# EAGLE design WebBrick6-0-64 (EAGLE 4.16)
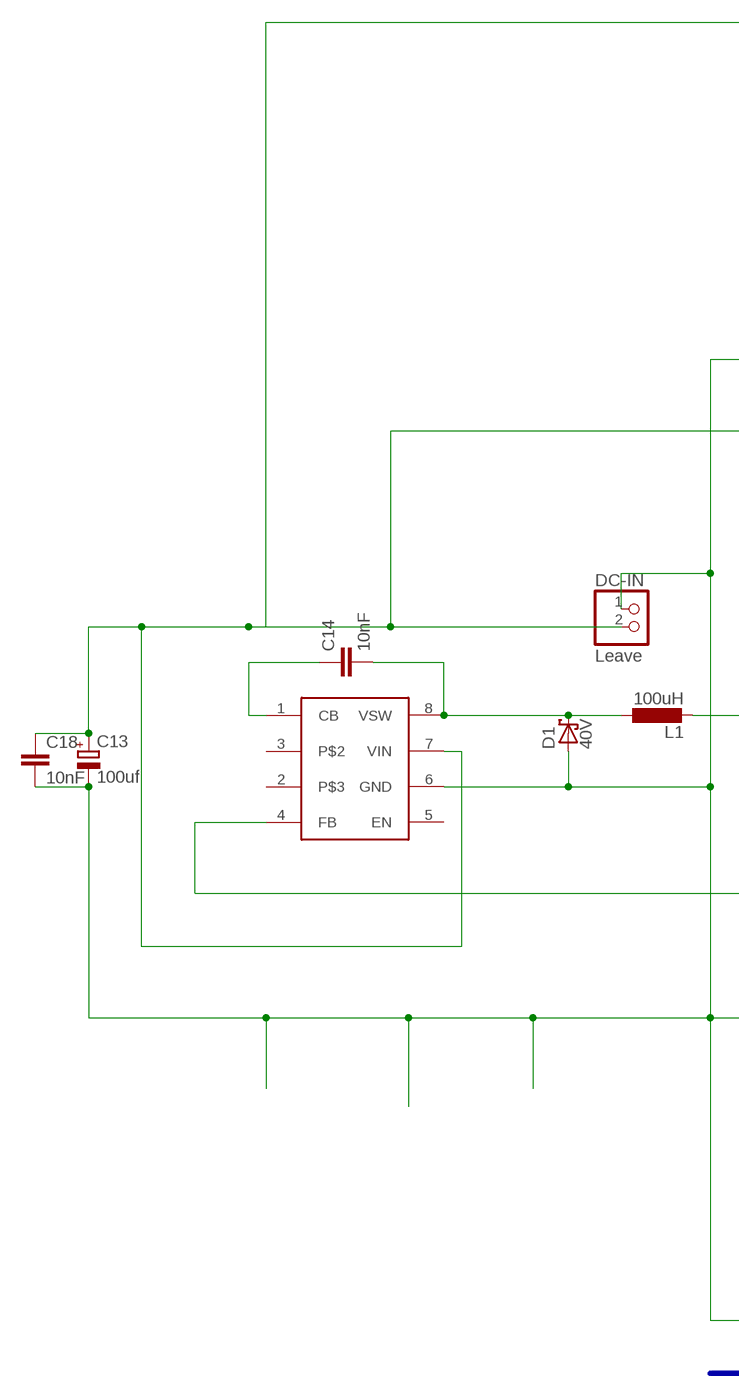
[diagram p0: schematic, sheet 1, part 1 of 2]
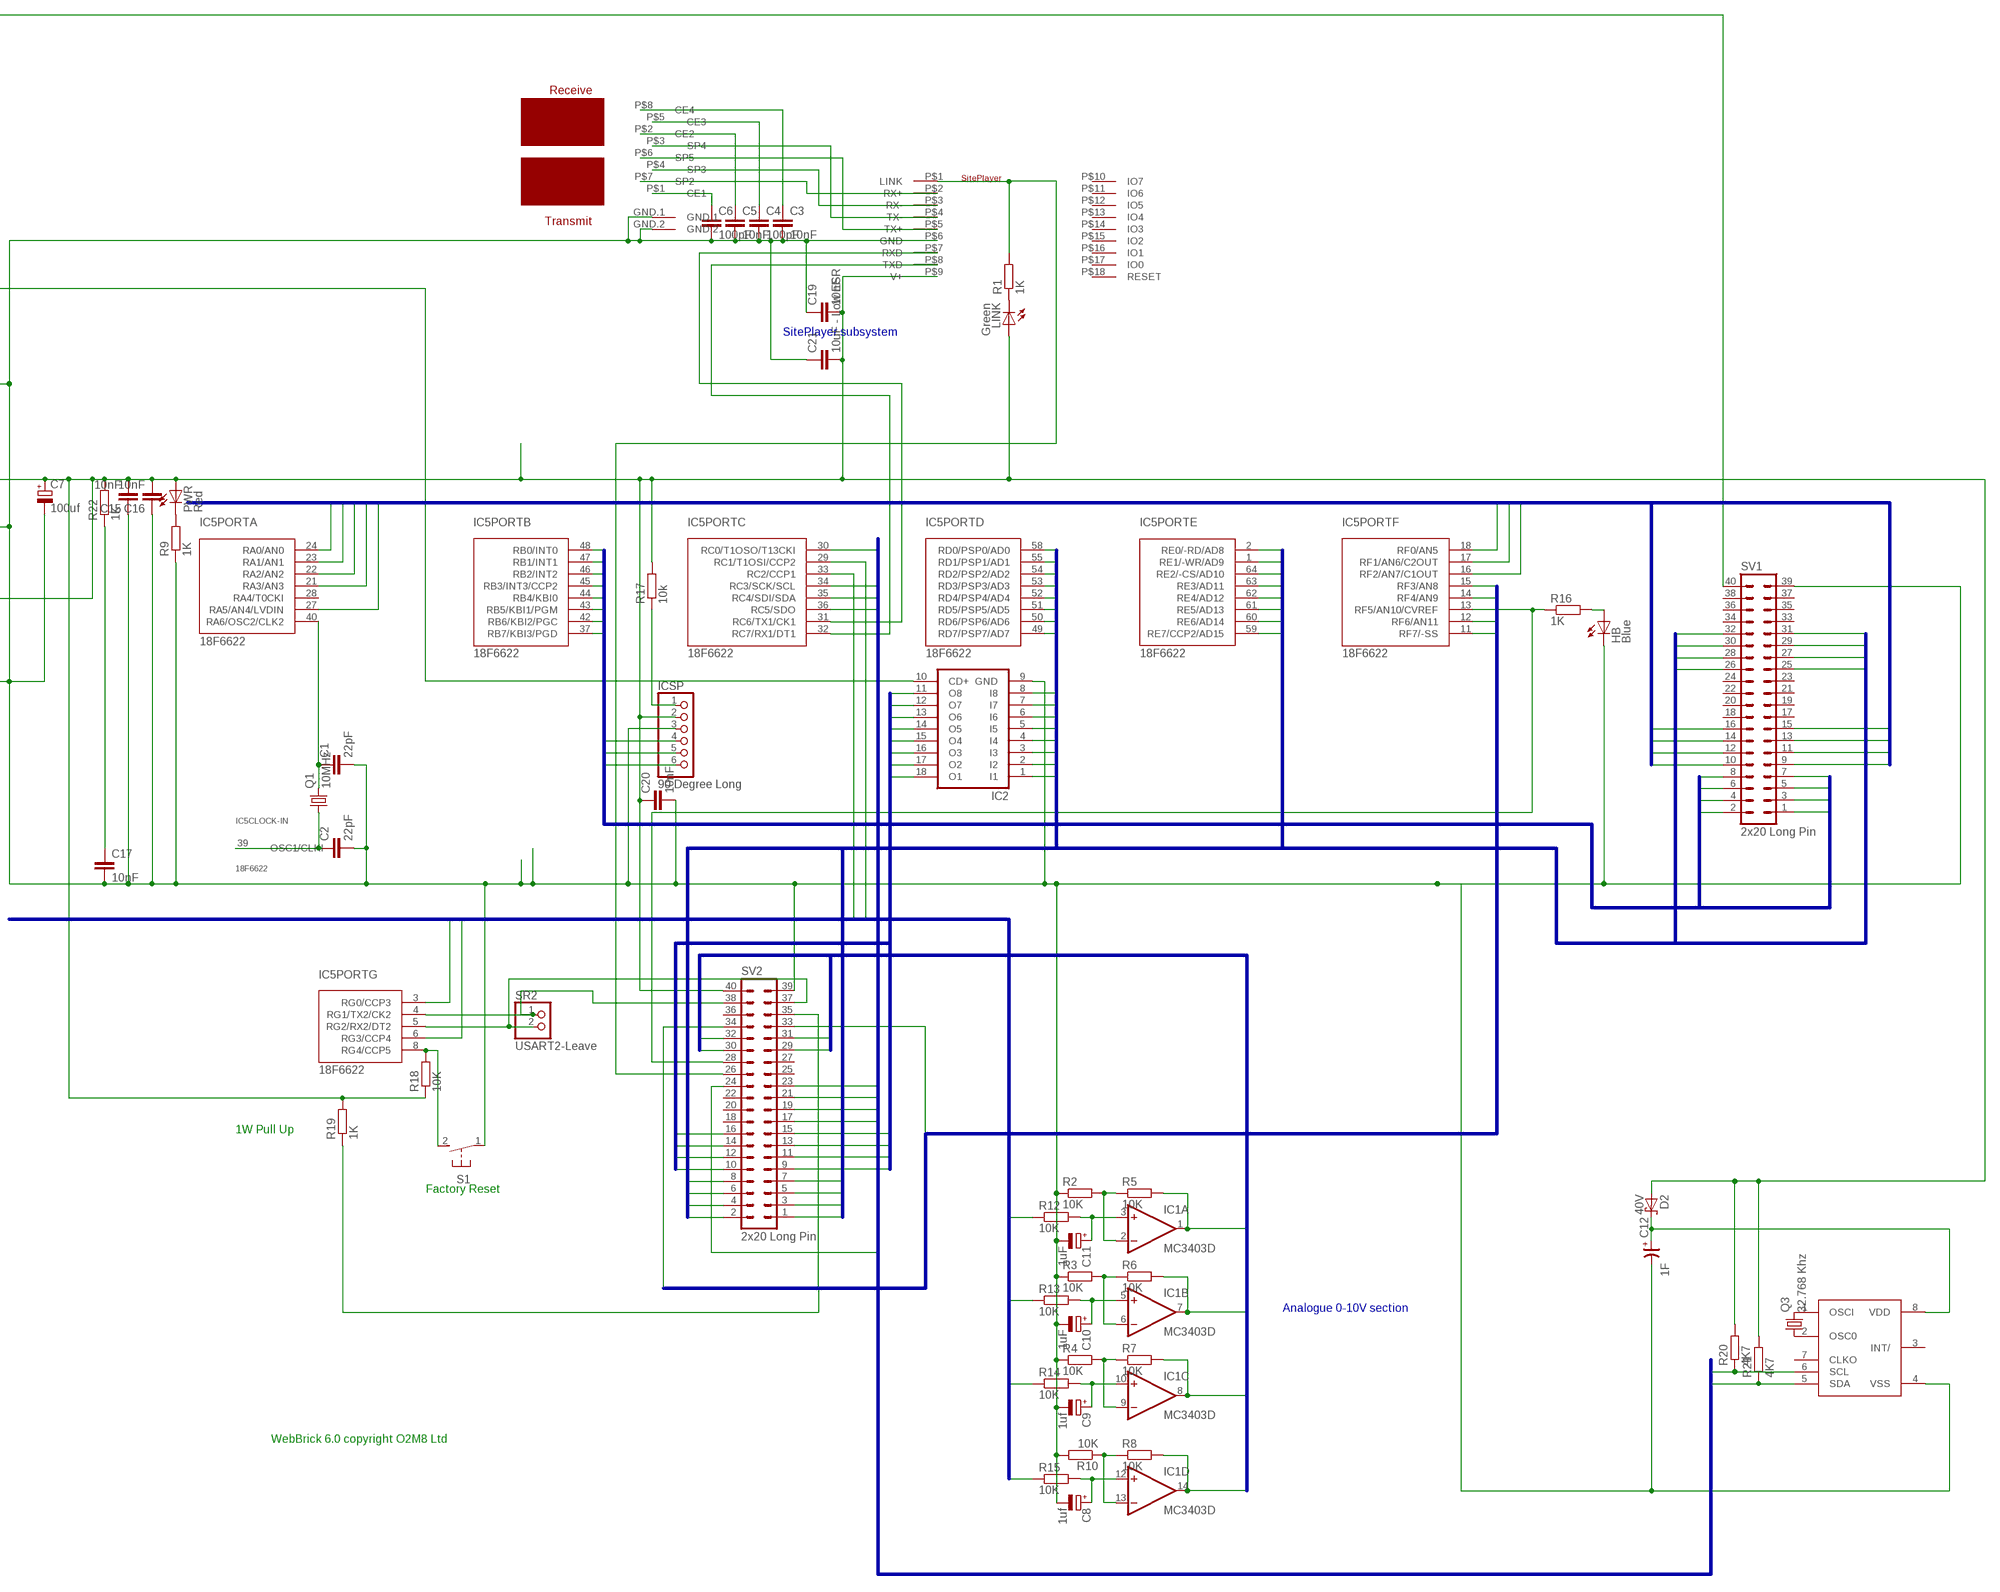
[diagram p1: schematic, sheet 1, part 2 of 2]

## Parts
C1  22pF  C-EUC1206  [C1206]
C2  22pF  C-EUC1206  [C1206]
C3  10nF  C-EUC1206  [C1206]
C4  100pF  C-EUC1206  [C1206]
C5  10nF  C-EUC1206  [C1206]
C6  100pF  C-EUC1206  [C1206]
C7  100uf  CPOL-EUF  [PANASONIC_F]
C8  1uf  CPOL-EUA/3216-18W  [A/3216-18W]
C9  1uf  CPOL-EUA/3216-18W  [A/3216-18W]
C10  1uF  CPOL-EUA/3216-18W  [A/3216-18W]
C11  1uF  CPOL-EUA/3216-18W  [A/3216-18W]
C12  1F  CP-SUPERCAPHORIZONTAL  [SUPERCAP-HORIZONTAL]
C13  100uf  CPOL-EUF  [PANASONIC_F]
C14  10nF  C-EUC1206  [C1206]
C15  10nF  C-EUC1206  [C1206]
C16  10nF  C-EUC1206  [C1206]
C17  10nF  C-EUC1206K  [C1206K]
C18  10nF  C-EUC1206K  [C1206K]
C19  10nF  C-EUC1206K  [C1206K]
C20  10nF  C-EUC1206K  [C1206K]
C21  10uF - Low ESR  C-EUC3216  [C3216]
D1  40V  SCHOTTKY-DIODE  [SOD123]
D2  40V  SCHOTTKY-DIODE  [SOD123]
DC-IN  Leave  PINHD-1X2  [1X02]
HB  Blue  LEDSMT1206  [1206]
IC1  MC3403D  MC34004D  [SO14]
IC2  ULN2803ASO18W  [SO18W]
IC3  PFC8563  PFC8563SO8  [SO8]
IC5  18F6622  PIC18F6720-I/PT  [TQFP64-10X10]
ICSP  90 Degree Long  PINHD-1X6  [1X06]
L1  100uH  L-EUL5650M  [L5650M]
LINK  Green  LEDSMT1206  [1206]
PWR  Red  LEDSMT1206  [1206]
Q1  10MHz  CRYTALHC49UP  [HC49UP]
Q3  32.768 Khz  CRYTALTC26V  [TC26V]
R1  1K  R-EU_R1206  [R1206]
R2  10K  R-EU_M1206  [M1206]
R3  10K  R-EU_M1206  [M1206]
R4  10K  R-EU_M1206  [M1206]
R5  10K  R-EU_M1206  [M1206]
R6  10K  R-EU_M1206  [M1206]
R7  10K  R-EU_M1206  [M1206]
R8  10K  R-EU_M1206  [M1206]
R9  1K  R-EU_R1206  [R1206]
R10  10K  R-EU_M1206  [M1206]
R12  10K  R-EU_M1206  [M1206]
R13  10K  R-EU_M1206  [M1206]
R14  10K  R-EU_M1206  [M1206]
R15  10K  R-EU_M1206  [M1206]
R16  1K  R-EU_M1206  [M1206]
R17  10k  R-EU_M1206  [M1206]
R18  10K  R-EU_M1206  [M1206]
R19  1K  R-EU_R1206  [R1206]
R20  4K7  R-EU_R1206  [R1206]
R21  4K7  R-EU_R1206  [R1206]
R22  1K  R-EU_R1206  [R1206]
S1  31-XX  [B3F-31XX]
SR2  USART2-Leave  PINHD-1X2  [1X02]
SV1  2x20 Long Pin  MA20-2  [MA20-2]
SV2  2x20 Long Pin  MA20-2  [MA20-2]
U$1  2off 1x9 PH  SP  [SITEPLAYER]
U$2  PCA EPJ9372  PULSETRANSFORMER  [PULSETRANSFORMER]
U$3  LM2674-5  [SO08]

## Nets
ANALOGUE0: IC5.33(PORTC:RC2/CCP1) R12.1
ANALOGUE1: IC5.29(PORTC:RC1/T1OSI/CCP2) R13.1
ANALOGUE2: IC5.3(PORTG:RG0/CCP3) R14.1
ANALOGUE3: IC5.6(PORTG:RG3/CCP4) R15.1
ANALOGUEIN0: IC5.24(PORTA:RA0/AN0) SV1.9
ANALOGUEIN1: IC5.23(PORTA:RA1/AN1) SV1.10
ANALOGUEIN2: IC5.22(PORTA:RA2/AN2) SV1.11
ANALOGUEIN3: IC5.21(PORTA:RA3/AN3) SV1.12
ANALOGUEIN4: IC5.27(PORTA:RA5/AN4/LVDIN) SV1.13
ANALOGUEIN5: IC5.18(PORTF:RF0/AN5) SV1.14
ANALOGUEIN6: IC5.17(PORTF:RF1/AN6/C2OUT) SV1.15
ANALOGUEIN7: IC5.16(PORTF:RF2/AN7/C1OUT) SV1.16
ANOUT0: IC1.1(A:OUT) R5.2 SV2.29
ANOUT1: IC1.7(B:OUT) R6.2 SV2.30
ANOUT2: IC1.8(C:OUT) R7.2 SV2.31
ANOUT3: IC1.14(D:OUT) R8.2 SV2.32
AVDD: C17.1 R22.1
CKI: IC5.30(PORTC:RC0/T1OSO/T13CKI) SV2.24
DATA [SUPPLY]: IC5.15(PORTF:RF3/AN8) R19.1 SV2.35
DINPUTS0: IC5.48(PORTB:RB0/INT0) SV1.1
DINPUTS1: IC5.47(PORTB:RB1/INT1) SV1.2
DINPUTS2: IC5.46(PORTB:RB2/INT2) SV1.3
DINPUTS3: IC5.45(PORTB:RB3/INT3/CCP2) SV1.4
DINPUTS4: IC5.44(PORTB:RB4/KBI0) SV1.5
DINPUTS5: IC5.43(PORTB:RB5/KBI1/PGM) ICSP.6 SV1.6
DINPUTS6: IC5.42(PORTB:RB6/KBI2/PGC) ICSP.5 SV1.7
DINPUTS7: IC5.37(PORTB:RB7/KBI3/PGD) ICSP.4 SV1.8
DOUTPUTS0: IC2.1(I1) IC5.58(PORTD:RD0/PSP0/AD0) SV2.1
DOUTPUTS1: IC2.2(I2) IC5.55(PORTD:RD1/PSP1/AD1) SV2.2
DOUTPUTS2: IC2.3(I3) IC5.54(PORTD:RD2/PSP2/AD2) SV2.3
DOUTPUTS3: IC2.4(I4) IC5.53(PORTD:RD3/PSP3/AD3) SV2.4
DOUTPUTS4: IC2.5(I5) IC5.52(PORTD:RD4/PSP4/AD4) SV2.5
DOUTPUTS5: IC2.6(I6) IC5.51(PORTD:RD5/PSP5/AD5) SV2.6
DOUTPUTS6: IC2.7(I7) IC5.50(PORTD:RD6/PSP6/AD6) SV2.7
DOUTPUTS7: IC2.8(I8) IC5.49(PORTD:RD7/PSP7/AD7) SV2.8
DOUTPUTS8: IC5.2(PORTE:RE0/-RD/AD8) SV1.25
DOUTPUTS9: IC5.1(PORTE:RE1/-WR/AD9) SV1.26
DOUTPUTS10: IC5.64(PORTE:RE2/-CS/AD10) SV1.27
DOUTPUTS11: IC5.63(PORTE:RE3/AD11) SV1.28
DOUTPUTS12: IC5.62(PORTE:RE4/AD12) SV1.29
DOUTPUTS13: IC5.61(PORTE:RE5/AD13) SV1.30
DOUTPUTS14: IC5.60(PORTE:RE6/AD14) SV1.31
DOUTPUTS15: IC5.59(PORTE:RE7/CCP2/AD15) SV1.32
DRIVE [SUPPLY]: IC5.14(PORTF:RF4/AN9)
GND [SUPPLY]: C1.2 C2.2 C3.2 C4.2 C5.2 C6.2 C7.- C8.- C9.- C10.- C11.- C12.C-(-) C13.- C15.1 C16.1 C17.2 C18.2 C19.1 C20.2 C21.1 D1.A DC-IN.1 HB.C IC2.9(GND) IC3.4(VSS) ICSP.3 R2.1 R3.1 R4.1 R9.1 R10.2 S1.1(P) SV1.39 SV2.39 U$1.P$6(GND) U$2.GND.1 U$2.GND.2 U$3.6(GND)
LINK: R1.2 SV2.26 U$1.P$1(LINK)
N$2: C1.1 IC5.40(PORTA:RA6/OSC2/CLK2) Q1.2
N$3: C2.1 IC5.39(CLOCK-IN:OSC1/CLKI) Q1.1
N$4 [SUPPLY]: C14.1 U$3.1(CB)
N$6 [SUPPLY]: C14.2 D1.C L1.1 U$3.8(VSW)
N$7: IC5.31(PORTC:RC6/TX1/CK1) U$1.P$7(RXD)
N$8: IC5.32(PORTC:RC7/RX1/DT1) U$1.P$8(TXD)
N$9: U$1.P$2(RX+) U$2.P$7(SP2)
N$10: LINK.C R1.1
N$11: IC5.8(PORTG:RG4/CCP5) R18.2 S1.2(S)
N$12: U$1.P$3(RX-) U$2.P$4(SP3)
N$13: U$1.P$4(TX-) U$2.P$3(SP4)
N$14: U$1.P$5(TX+) U$2.P$6(SP5)
N$15: C3.1 U$2.P$8(CE4)
N$16: C4.1 U$2.P$5(CE3)
N$17: C5.1 U$2.P$2(CE2)
N$18: PWR.C R9.2
N$19: C6.1 U$2.P$1(CE1)
N$21: IC1.6(B:-IN) R3.2 R6.1
N$22: IC1.2(A:-IN) R2.2 R5.1
N$23: C8.+ IC1.12(D:+IN) R15.2
N$24: IC5.13(PORTF:RF5/AN10/CVREF) R16.1 SV2.28
N$25: HB.A R16.2
N$26 [InSupply]: C12.C+(+) D2.C IC3.8(VDD)
N$28: IC3.1(OSCI) Q3.2
N$29: IC3.2(OSC0) Q3.1
N$30: C11.+ IC1.3(A:+IN) R12.2
N$31: C10.+ IC1.5(B:+IN) R13.2
N$32: C9.+ IC1.10(C:+IN) R14.2
N$33: IC1.9(C:-IN) R4.2 R7.1
N$35: IC1.13(D:-IN) R8.1 R10.1
OC0 [drive]: IC2.18(O1) SV2.9
OC1 [drive]: IC2.17(O2) SV2.10
OC2 [drive]: IC2.16(O3) SV2.11
OC3 [drive]: IC2.15(O4) SV2.12
OC4 [drive]: IC2.14(O5) SV2.13
OC5 [drive]: IC2.13(O6) SV2.14
OC6 [drive]: IC2.12(O7) SV2.15
OC7 [drive]: IC2.11(O8) SV2.16
ROTA [SUPPLY]: IC5.12(PORTF:RF6/AN11) SV2.33
ROTB: IC5.11(PORTF:RF7/-SS) SV2.34
SCA: IC3.5(SDA) IC5.35(PORTC:RC4/SDI/SDA) R21.1 SV2.21
SCL: IC3.6(SCL) IC5.34(PORTC:RC3/SCK/SCL) R20.1 SV2.17 SV2.23
SDO: IC5.36(PORTC:RC5/SDO) SV2.19
USART2RX: IC5.5(PORTG:RG2/RX2/DT2) SR2.2 SV2.37
USART2TX: IC5.4(PORTG:RG1/TX2/CK2) SR2.1 SV2.38
V+ [InSupply]: C13.+ C18.1 DC-IN.2 IC2.10(CD+) SV1.40 U$3.7(VIN)
VDD [SUPPLY]: C7.+ C15.2 C16.2 C19.2 C20.1 C21.2 D2.A ICSP.2 L1.2 LINK.A PWR.A R17.2 R18.1 R19.2 R20.2 R21.2 R22.2 SV2.40 U$1.P$9(V+) U$3.4(FB)
VPP: ICSP.1 R17.1
Unconnected: IC3.3(INT/) IC3.7(CLKO) IC5.28(PORTA:RA4/T0CKI) SV1.17 SV1.18 SV1.19 SV1.20 SV1.21 SV1.22 SV1.23 SV1.24 SV1.33 SV1.34 SV1.35 SV1.36 SV1.37 SV1.38 SV2.18 SV2.20 SV2.22 SV2.25 SV2.27 SV2.36 U$1.P$10(IO7) U$1.P$11(IO6) U$1.P$12(IO5) U$1.P$13(IO4) U$1.P$14(IO3) U$1.P$15(IO2) U$1.P$16(IO1) U$1.P$17(IO0) U$1.P$18(RESET) U$3.2 U$3.3 U$3.5(EN)

## Buses
ANALOGUE[0..4]
ANOUT[0..4]
DINPUTS[0..15]
DOUTPUTS[0..15]
ANALOGUEIN[0..7]
ANCILL:DATA,DRIVE,ROTA,ROTB
OC[0..7]
IC2:SCL,SCA,SDO,CKI

## Notes on the sheet
- SitePlayer subsystem
- 1W Pull Up
- Factory Reset
- Analogue 0-10V section
- WebBrick 6.0 copyright O2M8 Ltd

## Power pins joined to a net without a drawn wire
AVDD: IC5.19(POWER:AVDD)
GND: IC1.11(P:GND) IC5.9(POWER:GND) IC5.20(POWER:GND) IC5.25(POWER:GND) IC5.41(POWER:GND) IC5.56(POWER:GND)
V+: IC1.4(P:V+)
VDD: IC5.10(POWER:VDD) IC5.26(POWER:VDD) IC5.38(POWER:VDD) IC5.57(POWER:VDD)
VPP: IC5.7(POWER:VPP)

## Library data of the parts
C1-C6 C14-C21 = rcl:C-EU: CAPACITOR, European symbol
C7-C11 C13 = rcl:CPOL-EU: POLARIZED CAPACITOR, European symbol
C12 = cap-master:CP-: POLARIZED CAP
D1 D2 = diode:SCHOTTKY-DIODE: Schottky Diode
DC-IN SR2 = pinhead:PINHD-1X2: PIN HEADER
HB LINK PWR = led:LED: LED OSRAM: - CHIPLED LG R971, LG N971, LY N971, LG Q971, LY Q971, LO R971, LY R971 LH N974, LH R974 LS Q976, LO Q976, LY Q976 LO Q996 - Hyper CHIPLED LW Q18S LB Q993, LB Q99A, LB R99A - SideLED LS A670, LO A670, LY A670, LG A670, LP A670 LB A673, LV A673, LT A673, LW A673 LH A674 LY A675 LS A676, LA A676, LO A676, LY A676, LW A676 LS A679, LY A679, LG A679 - Hyper Micro SIDELED® LS Y876, LA Y876, LO Y876, LY Y876 LT Y87S - SmartLED LW L88C, LW L88S LB L89C, LB L89S, LG L890 LS L89K, LO L89K, LY L89K LS L896, LA L896, LO L896, LY L896 - TOPLED LS T670, LO T670, LY T670, LG T670, LP T670 LSG T670, LSP T670, LSY T670, LOP T670, LYG T670 LG T671, LOG T671, LSG T671 LB T673, LV T673, LT T673, LW T673 LH T674 LS T676, LA T676, LO T676, LY T676, LB T676, LH T676, LSB T676, LW T676 LB T67C, LV T67C, LT T67C, LS T67K, LO T67K, LY T67K, LW E67C LS E67B, LA E67B, LO E67B, LY E67B, LB E67C, LV E67C, LT E67C LW T67C LS T679, LY T679, LG T679 LS T770, LO T770, LY T770, LG T770, LP T770 LB T773, LV T773, LT T773, LW T773 LH T774 LS E675, LA E675, LY E675, LS T675 LS T776, LA T776, LO T776, LY T776, LB T776 LHGB T686 LT T68C, LB T68C - Hyper Mini TOPLED® LB M676 - Mini TOPLED Santana® LG M470 LS M47K, LO M47K, LY M47K Source: http://www.osram.convergy.de/
IC1 = linear:MC34004: OP AMP
IC2 = uln-udn:ULN2803A: DRIVER ARRAY
IC3 = micro-philips:PFC8563: I2C-Bus CLOCK/CALENDAR
IC5 = pic18fxx20-fxx8:PIC18F6*20: 64-Pin High Performance, 1 Mbit Enhanced FLASH Microcontrollers with A/D DEVICE DIFFERENCES Feature PIC18F6520 PIC18F6620 PIC18F6720 On-chip Program Memory (Kbytes) 32 64 128 Data Memory (bytes) 2048 3840 3840 Boot Block (bytes) 2048 512 512 Timer1 Low Power Option Yes No No I/O Ports Ports A, B, C, D, E, F, G Ports A, B, C, D, E, F, G Ports A, B, C, D, E, F, G A/D Channels 12 12 12 External Memory Interface No No No Package Types 64-pin TQFP 64-pin TQFP 64-pin TQFP NOTES: E suffix means the extended temperature range from -40°C to +120°C I suffix means the industrial temperature range from -40°C to +85°C F only after 18, means normal voltage range, like 18F6520 FL after 18, means extended voltage range, like 18FL6520
ICSP = pinhead:PINHD-1X6: PIN HEADER
L1 = rcl:L-EU: INDUCTOR, European symbol
Q1 Q3 = crystal:CRYTAL: CRYSTAL
R1-R10 R12-R22 = rcl:R-EU_: RESISTOR, European symbol
S1 = switch-omron:31-XX: OMRON SWITCH
SV1 SV2 = con-lstb:MA20-2: PIN HEADER
U$1 = siteplayer:SP: SitePlayer
U$2 = PulseTrans:PULSETRANSFORMER: 10 BASE-T FILTER
U$3 = LM2674:LM2674-5

## Net classes
1 SUPPLY: width 0.203 mm
2 drive: width 0.254 mm
3 InSupply: width 0.305 mm

## Board
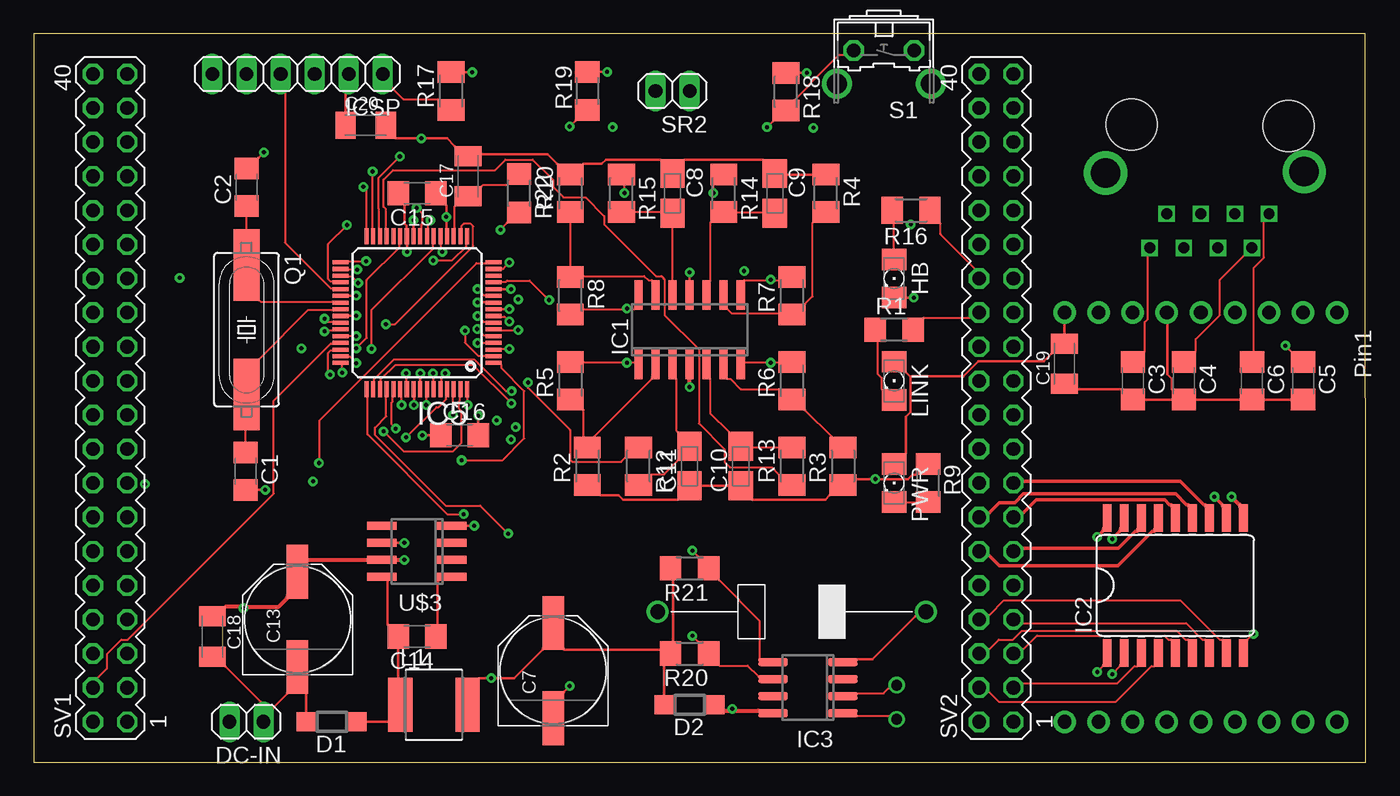
[diagram p2: board, top side]
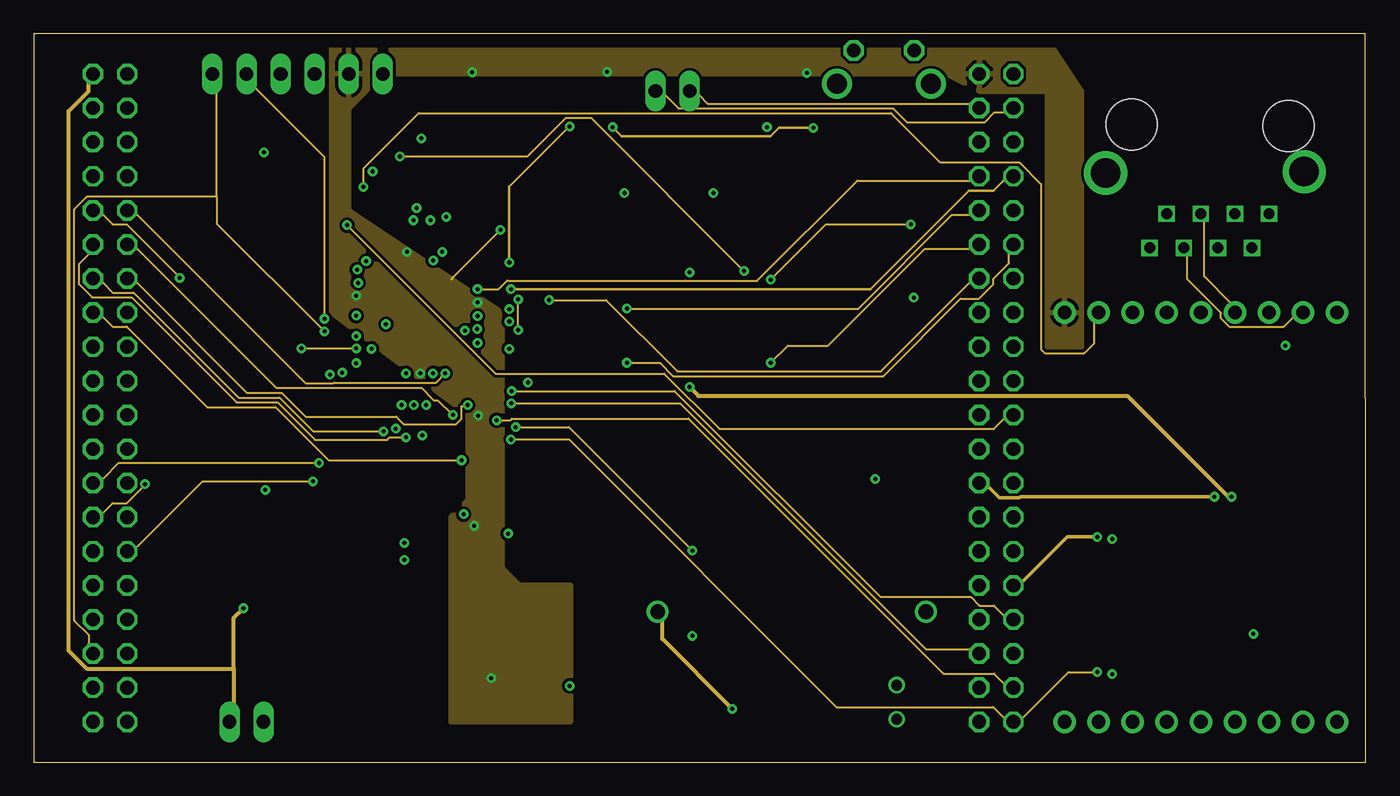
[diagram p3: board, inner layer Route2]
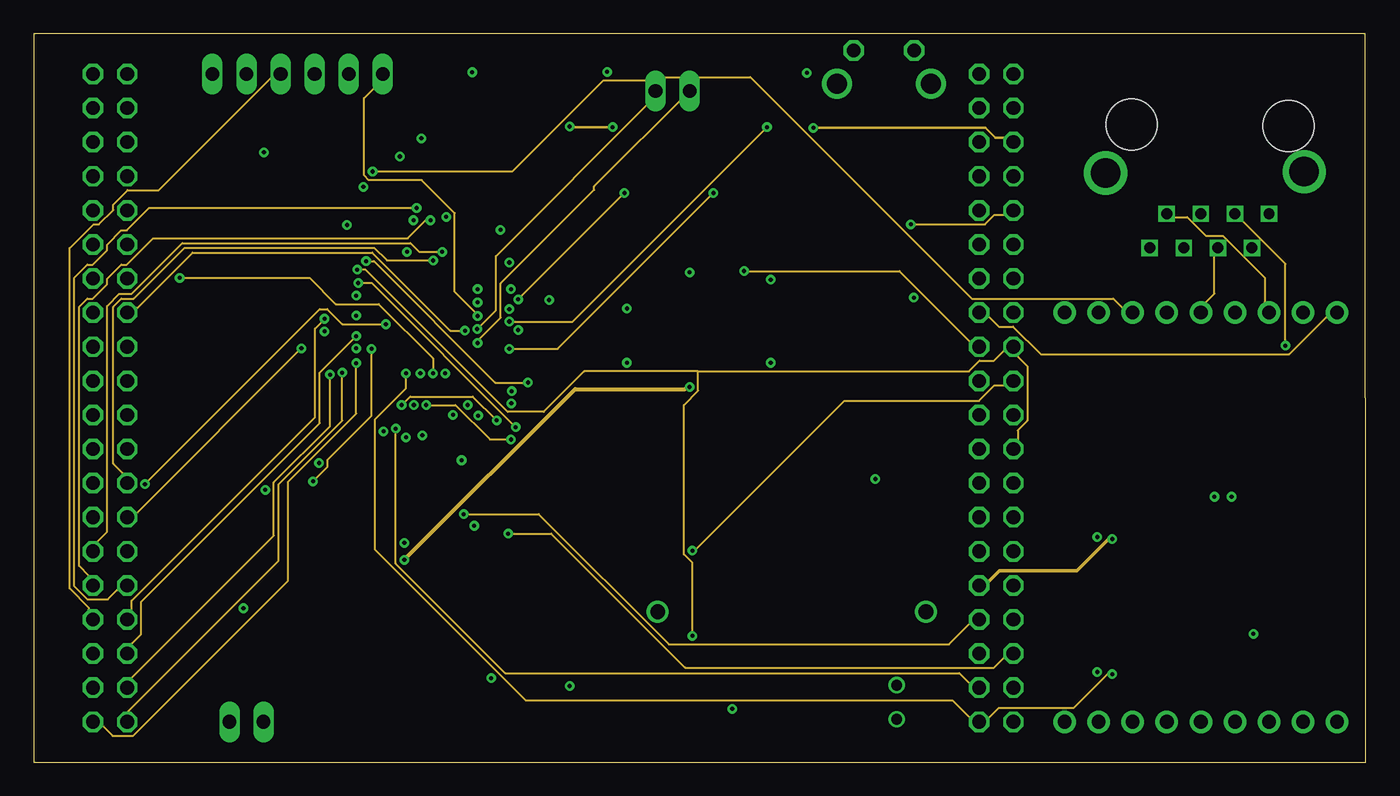
[diagram p4: board, inner layer Route15]
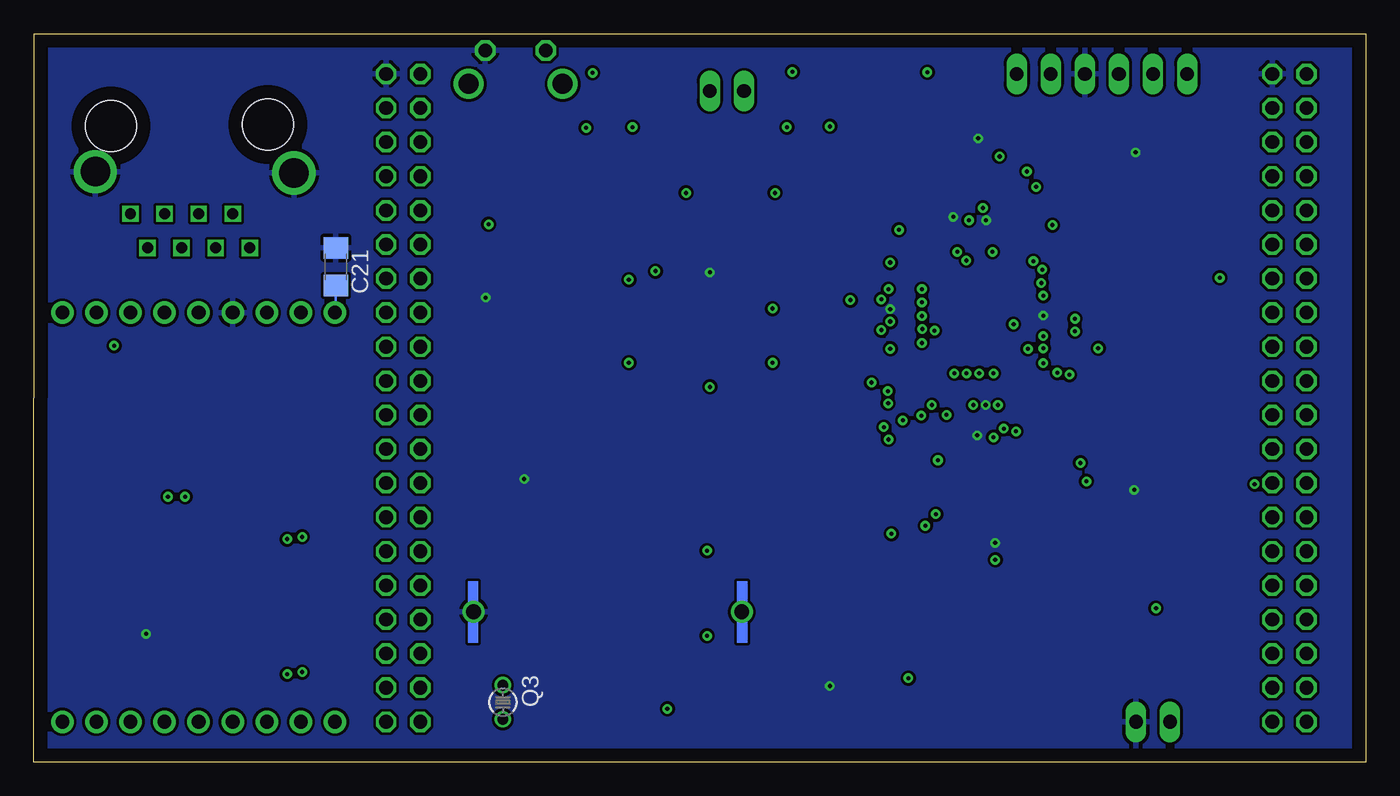
[diagram p5: board, bottom side, seen from below]

Size 99.29 x 54.28 mm. Coordinates in mm from the lower left corner, seen from the top.
Outline: 0,0 99.29,0 99.23,54.28 0,54.28 0,0
Copper layers (1*2*15*16): Top 0.035mm / dielectric 0.5mm / Route2 0.035mm / dielectric 0.5mm / Route15 0.035mm / dielectric 0.5mm / Bottom 0.035mm
Design rules "6-64Control": minimum track width 6mil, minimum drill 12mil, track to track 8mil, track to pad 8mil, pad to pad 8mil, via to via 8mil, smd to smd 6mil, copper to edge 40mil, drill to drill 8mil, minimum pad ring 8mil, minimum via ring 8mil, stop-mask expansion 2mil, vias tented up to drill 0mil, thermal gap 10mil

### Footprints (pad centres in the part's own frame; a part is rotated, then mirrored left to right if it is on the bottom)
C1206 = smd 1.6 x 1.8: 1 -1.4,0; 2 1.4,0
PANASONIC_F = smd 4 x 1.6: + 3.55,0; - -3.55,0
A/3216-18W = smd 2.15 x 1.8: + 1.475,0; - -1.475,0
SUPERCAP-HORIZONTAL = drill 1.1 round: C+ -10,0; C- 10,0
C1206K = smd 1.5 x 2: 1 -1.5,0; 2 1.5,0
C3216 = smd 1.6 x 1.8: 1 -1.4,0; 2 1.4,0
SOD123 = smd 1.4 x 1.4: A 1.9,0; C -1.9,0
1X02 = drill 1.016 long: 1 -1.27,0; 2 1.27,0
1206 = smd 1.6 x 1.803: A -1.422,0; C 1.422,0
SO14 = smd 0.6 x 2.2: 1 -3.81,-2.6; 2 -2.54,-2.6; 3 -1.27,-2.6; 4 0,-2.6; 5 1.27,-2.6; 6 2.54,-2.6; 7 3.81,-2.6; 8 3.81,2.6; 9 2.54,2.6; 10 1.27,2.6; 11 0,2.6; 12 -1.27,2.6; 13 -2.54,2.6; 14 -3.81,2.6
SO18W = smd 0.66 x 2.032: 1 -5.715,-5.029; 2 -4.445,-5.029; 3 -3.175,-5.029; 4 -1.905,-5.029; 5 -0.635,-5.029; 6 0.635,-5.029; 7 1.905,-5.029; 8 3.175,-5.029; 9 4.445,-5.029; 10 4.445,5.029; 11 3.175,5.029; 12 1.905,5.029; 13 0.635,5.029; 14 -0.635,5.029; 15 -1.905,5.029; 16 -3.175,5.029; 17 -4.445,5.029; 18 -5.715,5.029
SO8 = smd 0.6 x 2.2: 1 -1.905,-2.6; 2 -0.635,-2.6; 3 0.635,-2.6; 4 1.905,-2.6; 5 1.905,2.6; 6 0.635,2.6; 7 -0.635,2.6; 8 -1.905,2.6
TQFP64-10X10 = smd 1.2 x 0.3: 1 -5.7,3.75; 2 -5.7,3.25; 3 -5.7,2.75; 4 -5.7,2.25; 5 -5.7,1.75; 6 -5.7,1.25; 7 -5.7,0.75; 8 -5.7,0.25; 9 -5.7,-0.25; 10 -5.7,-0.75; 11 -5.7,-1.25; 12 -5.7,-1.75; 13 -5.7,-2.25; 14 -5.7,-2.75; 15 -5.7,-3.25; 16 -5.7,-3.75; 33 5.7,-3.75; 34 5.7,-3.25; 35 5.7,-2.75; 36 5.7,-2.25; 37 5.7,-1.75; 38 5.7,-1.25; 39 5.7,-0.75; 40 5.7,-0.25; 41 5.7,0.25; 42 5.7,0.75; 43 5.7,1.25; 44 5.7,1.75; 45 5.7,2.25; 46 5.7,2.75; 47 5.7,3.25; 48 5.7,3.75 | smd 0.3 x 1.2: 17 -3.75,-5.7; 18 -3.25,-5.7; 19 -2.75,-5.7; 20 -2.25,-5.7; 21 -1.75,-5.7; 22 -1.25,-5.7; 23 -0.75,-5.7; 24 -0.25,-5.7; 25 0.25,-5.7; 26 0.75,-5.7; 27 1.25,-5.7; 28 1.75,-5.7; 29 2.25,-5.7; 30 2.75,-5.7; 31 3.25,-5.7; 32 3.75,-5.7; 49 3.75,5.7; 50 3.25,5.7; 51 2.75,5.7; 52 2.25,5.7; 53 1.75,5.7; 54 1.25,5.7; 55 0.75,5.7; 56 0.25,5.7; 57 -0.25,5.7; 58 -0.75,5.7; 59 -1.25,5.7; 60 -1.75,5.7; 61 -2.25,5.7; 62 -2.75,5.7; 63 -3.25,5.7; 64 -3.75,5.7
1X06 = drill 1.016 long: 1 -6.35,0; 2 -3.81,0; 3 -1.27,0; 4 1.27,0; 5 3.81,0; 6 6.35,0
L5650M = smd 1.8 x 4: 1 -2.5,0; 2 2.5,0
HC49UP = smd 5.334 x 1.93: 1 -4.826,0; 2 4.826,0
TC26V = drill 0.813 round: 1 -1.27,0; 2 1.27,0
R1206 = smd 1.6 x 1.803: 1 -1.422,0; 2 1.422,0
M1206 = smd 1.6 x 2: 1 -1.4,0; 2 1.4,0
B3F-31XX = drill 1.016 octagon: 1 -2.261,-1.245; 2 2.261,-1.245 | drill 1.499 pad 2.159 round: 3 -3.505,1.245; 4 3.505,1.245
MA20-2 = drill 1.016 octagon: 1 -24.13,-1.27; 2 -24.13,1.27; 3 -21.59,-1.27; 4 -21.59,1.27; 5 -19.05,-1.27; 6 -19.05,1.27; 7 -16.51,-1.27; 8 -16.51,1.27; 9 -13.97,-1.27; 10 -13.97,1.27; 11 -11.43,-1.27; 12 -11.43,1.27; 13 -8.89,-1.27; 14 -8.89,1.27; 15 -6.35,-1.27; 16 -6.35,1.27; 17 -3.81,-1.27; 18 -3.81,1.27; 19 -1.27,-1.27; 20 -1.27,1.27; 21 1.27,-1.27; 22 1.27,1.27; 23 3.81,-1.27; 24 3.81,1.27; 25 6.35,-1.27; 26 6.35,1.27; 27 8.89,-1.27; 28 8.89,1.27; 29 11.43,-1.27; 30 11.43,1.27; 31 13.97,-1.27; 32 13.97,1.27; 33 16.51,-1.27; 34 16.51,1.27; 35 19.05,-1.27; 36 19.05,1.27; 37 21.59,-1.27; 38 21.59,1.27; 39 24.13,-1.27; 40 24.13,1.27
SITEPLAYER = drill 1.016 pad 1.676 round: P$1 -15.24,10.16; P$2 -15.24,7.62; P$3 -15.24,5.08; P$4 -15.24,2.54; P$5 -15.24,0; P$6 -15.24,-2.54; P$7 -15.24,-5.08; P$8 -15.24,-7.62; P$9 -15.24,-10.16; P$10 15.24,10.16; P$11 15.24,7.62; P$12 15.24,5.08; P$13 15.24,2.54; P$14 15.24,0; P$15 15.24,-2.54; P$16 15.24,-5.08; P$17 15.24,-7.62; P$18 15.24,-10.16
PULSETRANSFORMER = drill 2.2 round: GND.1 -7.7,-0.6; GND.2 7.1,-0.5 | drill 0.813 square: P$1 -5.08,2.54; P$2 -2.54,2.54; P$3 0,2.54; P$4 2.54,2.54; P$5 -3.81,5.08; P$6 -1.27,5.08; P$7 1.27,5.08; P$8 3.81,5.08 | hole 3.81: 5.172,-4.11; -6.55,-4.01
SO08 = smd 0.6 x 2.2: 1 -1.905,-2.6; 2 -0.635,-2.6; 3 0.635,-2.6; 4 1.905,-2.6; 5 1.905,2.6; 6 0.635,2.6; 7 -0.635,2.6; 8 -1.905,2.6

### Placement (x,y rotation side)
C1  15.81,21.68 270 top
C2  15.87,42.82 90 top
C3  81.91,28.41 270 top
C4  85.72,28.41 270 top
C5  94.61,28.41 270 top
C6  90.8,28.41 270 top
C7  38.73,6.82 90 top
C8  47.62,42.38 270 top
C9  55.24,42.38 270 top
C10  52.7,22.06 90 top
C11  48.89,22.06 90 top
C12  56.51,11.2 0 top
C13  19.68,10.63 90 top
C14  28.57,9.36 180 top
C15  28.57,42.38 180 top
C16  31.74,24.35 0 top
C17  32.38,43.65 90 top
C18  13.33,9.36 270 top
C19  76.83,29.68 90 top
C20  24.76,47.46 0 top
C21  76.77,36.92 270 bottom
D1  22.22,3.01 180 top
D2  48.89,4.28 180 top
DC-IN  15.87,3.01 180 top
HB  64.13,36.03 270 top
IC1  48.89,32.22 0 top
IC2  85.72,13.17 0 top
IC3  57.72,5.55 90 top
IC5  28.57,33.49 180 top
ICSP  19.68,51.27 180 top
L1  29.84,4.28 0 top
LINK  64.13,28.41 270 top
PWR  64.13,20.79 270 top
Q1  15.87,32.22 270 top
Q3  64.32,4.47 270 bottom
R1  64.13,32.22 0 top
R2  41.27,22.06 90 top
R3  60.32,22.06 90 top
R4  59.05,42.38 270 top
R5  40,28.41 90 top
R6  56.51,28.41 90 top
R7  56.51,34.76 90 top
R8  40,34.76 270 top
R9  66.67,20.79 270 top
R10  40,42.38 90 top
R12  45.08,22.06 270 top
R13  56.51,22.06 90 top
R14  51.43,42.38 270 top
R15  43.81,42.38 270 top
R16  65.4,41.11 180 top
R17  31.11,50 90 top
R18  56.07,49.94 270 top
R19  41.27,50 90 top
R20  48.89,8.09 180 top
R21  48.89,14.44 180 top
R22  36.19,42.38 270 top
S1  63.37,51.78 180 top
SR2  47.62,50 180 top
SV1  5.71,27.14 90 top
SV2  71.75,27.14 90 top
U$1  86.99,18.25 270 top
U$2  86.99,43.4 180 top
U$3  28.57,15.71 90 top

### Tracks (layer width: path | path; a pad name or v marks a point on that pad's centre or on a via)
ANALOGUE0  (via drill 0.3)
  Top 0.152: v24.79,37.32 23.46,37.32 IC5.33 | v36.85,28.28 36.85,27.88 39.98,24.75 39.98,22.54 40.15,22.36 43.79,22.36 44.09,22.67 R12.1
  Route15 0.152: v24.79,37.32 25.37,37.32 34.41,28.28 v36.85,28.28
ANALOGUE1
  Top 0.152: IC5.29 26.26,39.79 26.26,41.19 26.08,41.36 26.08,43.4 26.79,44.11 34.39,44.11 35.17,44.89 37.21,44.89 38.71,43.4 38.71,42.86 39.49,42.07 41.12,42.07 42.52,40.68 42.52,40.07 46.38,36.21 46.78,36.21 47.04,35.95 47.04,33.31 49.58,30.77 49.58,25.23 51.51,23.3 51.51,22.34 51.89,21.96 55.01,21.96 55.52,21.45 R13.1
ANALOGUE2  (via drill 0.3)
  Top 0.152: v35.45,30.8 34.87,30.8 IC5.3 | v50.67,42.41 50.67,42.99 R14.1
  Route15 0.152: v35.45,30.8 39.06,30.8 v50.67,42.41
ANALOGUE3  (via drill 0.3)
  Top 0.152: v36.11,32.2 34.87,32.2 IC5.6 | v44.04,42.41 44.04,42.99 R15.1
  Route2 0.152: v36.11,32.2 v36.11,34.48
  Route15 0.152: v36.11,34.48 v44.04,42.41
ANALOGUEIN0  (via drill 0.3)
  Top 0.152: v28.54,41.29 28.95,40.88 28.95,40.09 28.88,40.02 28.88,39.79 IC5.24
  Route15 0.152: v28.54,41.29 8.63,41.29 6.96,39.61 6.55,39.61 5.48,38.55 5.48,38.14 4.42,37.07 4.01,37.07 3.04,36.11 3.04,13.09 4.01,12.13 5.53,12.13 6.24,12.84 SV1.9
ANALOGUEIN1  (via drill 0.3)
  Top 0.152: v29.59,40.37 29.38,40.17 29.38,39.79 IC5.23
  Route15 0.152: v29.59,40.37 29.23,40.37 27.88,39.03 8.91,39.03 6.96,37.07 6.55,37.07 5.48,36 5.48,35.6 4.42,34.53 4.01,34.53 3.4,33.92 3.4,14.62 4.11,13.91 SV1.10
ANALOGUEIN2  (via drill 0.3)
  Top 0.152: v25.19,30.8 25.19,33.69 29.76,38.27 29.76,38.59 IC5.22
  Route2 0.152: v20.82,20.92 12.59,20.92 7.72,16.04 SV1.11
  Route15 0.152: v25.19,30.8 25.19,25.79 21.91,22.52 21.91,22.01 v20.82,20.92
ANALOGUEIN3  (via drill 0.3)
  Top 0.152: v30.45,38.01 30.37,38.09 30.37,38.59 IC5.21
  Route15 0.152: v30.45,38.01 28.75,38.01 28.09,38.67 11.1,38.67 7.31,34.89 6.4,34.89 5.48,33.97 5.48,17.16 4.77,16.45 SV1.12
ANALOGUEIN4  (via drill 0.3)
  Top 0.152: v24.05,30.82 24.84,31.61 24.84,35.93 27.27,38.37 27.27,38.59 IC5.27
  Route2 0.152: v19.96,30.82 v24.05,30.82
  Route15 0.152: v19.96,30.82 7.72,18.58 SV1.13
ANALOGUEIN5  (via drill 0.3)
  Top 0.152: v26.26,32.63 26.94,32.63 32.76,38.44 32.76,39.92 32.58,40.09 32.05,40.09 31.87,39.92 31.87,39.79 IC5.18
  Route2 0.152: v8.3,20.71 8.3,20.64 6.96,19.29 5.89,19.29 5.18,18.58 SV1.14
  Route15 0.152: v26.26,32.63 23.01,32.63 21.89,33.74 21.33,33.74 v8.3,20.71
ANALOGUEIN6  (via drill 0.3)
  Top 0.152: v29.79,37.38 31.19,37.38 32.25,38.44 32.25,38.59 IC5.17
  Route15 0.152: v29.79,37.38 26.33,37.38 25.39,38.32 11.25,38.32 7.46,34.53 6.55,34.53 5.94,33.92 5.94,22.24 6.65,21.53 SV1.15
ANALOGUEIN7  (via drill 0.3)
  Top 0.152: v21.28,22.29 21.33,22.34 21.33,25.49 33.02,37.17 33.68,37.17 IC5.16
  Route2 0.152: v21.28,22.29 6.34,22.29 5.18,21.12 SV1.16
ANOUT0  (via drill 0.3)
  Top 0.152: 44.22,29.81 44.8,29.81 IC1.1 | 44.22,29.81 40.99,29.81 R5.2 | 44.22,29.81 v44.22,29.76
  Route2 0.152: v44.22,29.76 46.68,29.76 47.67,28.77 63.32,28.77 69.08,34.53 70.45,34.53 71.52,35.6 71.52,36 72.69,37.17 72.69,37.83 SV2.29
ANOUT1  (via drill 0.3)
  Top 0.152: 54.94,29.81 52.98,29.81 IC1.7 | 54.94,29.81 55.52,29.81 R6.2 | 54.94,29.81 v54.94,29.76
  Route2 0.152: v54.94,29.76 56.21,31.03 59.2,31.03 66.42,38.24 69.74,38.24 SV2.30
ANOUT2  (via drill 0.3)
  Top 0.152: 54.94,35.9 52.98,35.9 IC1.8 | 54.94,35.9 55.52,35.9 R7.2 | 54.94,35.9 v54.94,35.95
  Route2 0.152: v65.38,40.07 59.05,40.07 v54.94,35.95
  Route15 0.152: v65.38,40.07 70.91,40.07 71.62,40.78 72.28,40.78 SV2.31
ANOUT3  (via drill 0.3)
  Top 0.152: 44.22,33.74 44.8,33.74 IC1.14 | 44.22,33.74 40.99,33.74 R8.2 | 44.22,33.74 v44.22,33.8
  Route2 0.152: v44.22,33.8 61.46,33.8 68.45,40.78 69.74,40.78 SV2.32
AVDD
  Top 0.152: IC5.19 31.39,39.79 31.39,41.41 C17.1 33.37,42.89 33.5,43.02 35.3,43.02 R22.1
CKI  (via drill 0.3)
  Top 0.152: v27.3,45.12 25.72,43.55 25.72,41.21 25.75,41.19 25.75,39.79 IC5.30
  Route2 0.152: v27.3,45.12 36.8,45.12 39.67,47.99 41.55,47.99 v52.95,36.59
  Route15 0.152: v52.95,36.59 64.54,36.59 69.79,31.33 SV2.24
DATA  (via drill 0.3)
  Top 0.203: v35.45,37.22 35,36.77 34.87,36.77 IC5.15 | v39.95,47.36 40.38,47.79 R19.1
  Route2 0.203: v35.45,37.22 35.45,42.86 v39.95,47.36 | v58.11,47.26 55.55,47.26 54.94,46.65 43.81,46.65 v43.15,47.31
  Route15 0.203: v58.11,47.26 70.94,47.26 71.67,46.52 72.28,46.52 SV2.35 | v43.15,47.31 40.28,47.31 v39.95,47.36
DINPUTS0  (via drill 0.3)
  Top 0.152: v23.01,29.02 23.01,29.6 IC5.48
  Route15 0.152: v23.01,29.02 23.01,25.44 18.26,20.69 18.26,15 7,3.75 SV1.1
DINPUTS1  (via drill 0.3)
  Top 0.152: v24.05,29.73 23.59,30.19 23.46,30.19 IC5.47
  Route15 0.152: v24.05,29.73 24.05,25.97 18.97,20.89 18.97,13.53 7.41,1.97 5.89,1.97 5.18,2.68 SV1.2
DINPUTS2  (via drill 0.3)
  Top 0.152: v22.09,28.87 21.97,28.99 21.97,30.49 22.14,30.67 22.27,30.67 IC5.46
  Route15 0.152: v22.09,28.87 22.09,25.03 17.9,20.84 17.9,16.88 7.31,6.29 SV1.3
DINPUTS3
  Top 0.152: IC5.45 22.27,31.18 22.14,31.18 17.9,26.94 17.9,20 7.03,9.13 6.55,9.13 5.48,8.06 5.48,7 4.77,6.29 SV1.4
DINPUTS4  (via drill 0.3)
  Top 0.152: v24.05,31.74 23.46,31.74 IC5.44
  Route15 0.152: v24.05,31.74 21.33,29.02 21.33,25.26 8.02,11.95 8.02,9.54 7.31,8.83 SV1.5
DINPUTS5  (via drill 0.3)
  Top 0.152: v21.69,32.09 21.79,32.2 22.27,32.2 IC5.43
  Route2 0.152: v21.69,32.09 13.66,40.12 13.66,42.15 | 13.66,42.15 13.66,50.53 ICSP.6 | SV1.6 4.11,8.83 4.11,9.49 3.04,10.55 3.04,41.19 4.01,42.15 13.66,42.15
DINPUTS6  (via drill 0.3)
  Top 0.152: v21.69,33.03 21.91,32.8 22.27,32.8 IC5.42
  Route2 0.152: v21.69,33.03 21.69,45.05 16.2,50.53 ICSP.5
  Route15 0.152: SV1.7 7.31,11.37 7.31,12.03 20.97,25.69 20.97,32.3 21.46,32.78 v21.69,33.03
DINPUTS7
  Top 0.152: IC5.37 22.27,35.29 22.14,35.29 18.74,38.7 18.74,49.77 ICSP.4
  Route15 0.152: SV1.8 4.11,11.37 4.11,11.52 2.69,12.94 2.69,38.29 4.46,40.07 4.87,40.07 5.94,41.13 5.94,41.54 7,42.61 9.34,42.61 17.67,50.94 ICSP.4
DOUTPUTS0  (via drill 0.3)
  Top 0.152: v29.26,26.61 29.26,27.19 IC5.58 | v79.27,6.72 79.7,7.15 IC2.1
  Route2 0.152: v35.58,24.04 39.9,24.04 59.84,4.1 71.52,4.1 72.28,3.34 SV2.1 73.76,3.34 77.13,6.72 v79.27,6.72
  Route15 0.152: v29.26,26.61 31.44,26.61 34.01,24.04 v35.58,24.04
DOUTPUTS1  (via drill 0.3)
  Top 0.152: v27.76,28.97 27.76,28.38 IC5.55 | v80.39,6.57 80.97,7.15 IC2.2
  Route15 0.152: v27.76,28.97 27.76,27.85 25.45,25.54 25.45,15.84 36.67,4.61 68.47,4.61 69.74,3.34 SV2.2 71.22,3.34 71.93,4.05 77.52,4.05 80.03,6.57 v80.39,6.57
DOUTPUTS2  (via drill 0.3)
  Top 0.152: v27.43,26.61 27.38,26.66 27.38,27.19 IC5.54 | IC2.3 82.24,7.15 82.04,7.15 80.77,5.88 73.76,5.88 SV2.3
  Route2 0.152: v34.51,25.46 35.53,25.46 35.66,25.59 48.81,25.59 67.81,6.59 71.57,6.59 72.28,5.88 SV2.3
  Route15 0.152: v27.43,26.61 28.06,27.24 32.74,27.24 v34.51,25.46
DOUTPUTS3  (via drill 0.3)
  Top 0.152: v26.99,24.85 26.69,25.16 26.69,26.81 26.77,26.89 26.77,27.19 IC5.53 | IC2.4 83.51,7.15 83.31,7.15 80.66,4.51 71.93,4.51 71.22,5.22 SV2.4
  Route15 0.152: v26.99,24.85 26.99,14.8 35.15,6.64 68.98,6.64 69.74,5.88 SV2.4
DOUTPUTS4  (via drill 0.3)
  Top 0.152: v35.38,17.03 33.29,19.11 30.7,19.11 25.45,24.37 25.45,24.93 26.28,25.77 26.28,27.19 IC5.52 | IC2.5 84.78,9.13 84.58,9.13 84.27,9.44 74.77,9.44 73.76,8.42 SV2.5
  Route15 0.152: v35.38,17.03 38.58,17.03 48.56,7.05 71.57,7.05 72.28,7.76 SV2.5
DOUTPUTS5  (via drill 0.3)
  Top 0.152: v35.61,26.73 32.74,29.6 26.97,29.6 25.88,28.51 25.88,28.38 IC5.51 | IC2.6 86.05,9.13 85.85,9.13 85.19,9.79 73.66,9.79 72.99,9.13 71.93,9.13 71.22,8.42 SV2.6
  Route2 0.152: v35.61,26.73 48.18,26.73 66.49,8.42 69.74,8.42 SV2.6
DOUTPUTS6  (via drill 0.3)
  Top 0.152: v35.63,27.65 35.2,27.65 32.84,30.01 26.87,30.01 25.37,28.51 25.37,28.38 IC5.50 | IC2.7 87.32,9.13 87.12,9.13 85.9,10.35 73.76,10.35 SV2.7
  Route2 0.152: v35.63,27.65 47.77,27.65 63.11,12.31 69.87,12.31 70.5,11.67 71.57,11.67 72.28,10.96 SV2.7
DOUTPUTS7  (via drill 0.3)
  Top 0.152: v32.05,18.48 30.83,18.48 24.89,24.42 24.89,27.19 IC5.49 | IC2.8 88.59,9.13 88.39,9.13 85.47,12.05 72.31,12.05 71.22,10.96 SV2.8
  Route15 0.152: v32.05,18.48 37.64,18.48 47.34,8.78 68.22,8.78 69.74,10.3 SV2.8
DOUTPUTS8  (via drill 0.3)
  Top 0.152: v32.15,32.14 32.15,31.25 33.12,30.29 33.68,30.29 IC5.2
  Route15 0.152: v32.15,32.14 31.06,32.14 25.24,37.96 11.86,37.96 7.72,33.82 SV1.25
DOUTPUTS9  (via drill 0.3)
  Top 0.152: v31.9,22.49 34.95,22.49 36.57,24.12 36.57,27.65 34.87,29.35 34.87,29.6 IC5.1
  Route2 0.152: v31.9,22.49 21.99,22.49 18.03,26.45 12.95,26.45 6.96,32.45 5.89,32.45 5.18,33.16 SV1.26
DOUTPUTS10  (via drill 0.3)
  Top 0.152: v32.36,26.61 32.36,27.19 IC5.64
  Route2 0.152: v32.36,26.61 32.28,26.53 31.9,26.53 31.9,25.59 31.49,25.18 27.58,25.18 27.02,25.74 20.26,25.74 18.49,27.52 15.9,27.52 7.72,35.7 SV1.27
DOUTPUTS11  (via drill 0.3)
  Top 0.152: v26.08,24.65 27.58,23.15 31.26,23.15 31.9,23.79 31.9,26.15 31.72,26.33 31.72,26.89 31.77,26.94 31.77,27.19 IC5.63
  Route2 0.152: v26.08,24.65 20.85,24.65 18.33,27.16 15.29,27.16 7.46,34.99 5.89,34.99 5.18,35.7 SV1.28
DOUTPUTS12  (via drill 0.3)
  Top 0.152: v31.26,25.87 31.26,27.19 IC5.62
  Route2 0.152: v31.26,25.87 31.21,25.87 30.12,26.96 29.81,26.96 28.9,27.88 18.08,27.88 7.72,38.24 SV1.29
DOUTPUTS13  (via drill 0.3)
  Top 0.152: v27.76,24.19 30.02,26.45 30.17,26.45 30.75,27.04 30.75,27.19 IC5.61
  Route2 0.152: v27.76,24.19 26.54,24.19 26.36,24.02 20.97,24.02 18.18,26.81 15.13,26.81 7.31,34.63 4.36,34.63 3.4,35.6 3.4,37.12 4.11,37.83 SV1.30
DOUTPUTS14  (via drill 0.3)
  Top 0.152: v30.68,28.97 30.37,28.66 30.37,28.38 IC5.60
  Route2 0.152: v30.68,28.97 29.99,28.28 22.42,28.28 22.37,28.23 20.26,28.23 7.72,40.78 SV1.31
DOUTPUTS15  (via drill 0.3)
  Top 0.152: v29.76,28.97 29.76,28.38 IC5.59
  Route2 0.152: v10.89,36.08 10.89,36.13 6.96,40.07 5.89,40.07 5.18,40.78 SV1.32
  Route15 0.152: v29.76,28.97 29.76,30.09 25.72,34.12 22.52,34.12 20.57,36.08 v10.89,36.08
GND  (via drill 0.3)
  Top 0.203: C20.2 26.99,46.47 v28.9,46.47 30.8,46.47 31.39,45.88 C17.2 33.37,45.28 38.3,45.28 39.01,44.56 R10.2 40.99,44.56 42.34,44.56 42.67,44.89 46.73,44.89 C8.- 48.51,44.89 54.35,44.89 C9.- 56.13,43.78 58.06,43.78 R4.1 | C5.2 93.72,27.01 91.69,27.01 C6.2 89.91,27.01 86.61,27.01 C4.2 | C4.2 84.83,27.01 82.8,27.01 C3.2 81.02,27.8 77.82,27.8 C19.1 | R2.1 42.26,19.88 43.61,19.88 43.94,19.54 48,19.54 C11.- 49.78,20.59 51.81,20.59 C10.- 53.59,19.54 59,19.54 59.33,19.88 R3.1 61.31,21.09 v62.73,21.09 65.17,21.09 65.5,21.42 65.78,21.42 R9.1 | D1.A 20.31,3.7 20.31,5.09 C13.- 18.89,5.09 17.88,4.08 DC-IN.1 16.94,4.51 14.32,7.12 C18.2 | 30.78,40.63 30.78,41.47 30.75,41.49 C15.1 | 30.78,40.63 30.78,39.79 IC5.20 | v28.34,26.61 28.34,27.19 IC5.56 | v24.05,33.26 23.46,33.26 IC5.41 | v28.32,40.37 28.32,39.79 IC5.25 | v35.45,33.74 34.87,33.74 IC5.9 | v17.27,20.28 16.68,20.28 C1.2 | C16.1 v28.98,24.35 | v17.16,45.43 16.76,45.02 C2.2 | v65.6,34.61 65.02,34.61 HB.C | v90.9,9.56 90.47,9.13 IC2.9 | U$3.6 v27.63,16.34 | IC3.4 61.41,7.66 62.5,7.66 65.7,10.86 C12.C- | IC1.11 v48.89,36.49 | 30.78,40.63 v30.75,40.63 | v39.95,5.68 39.52,5.25 C7.- | C4.2 84.83,27.8 84.83,28.56 84.5,28.89 84.5,32.68 U$1.P$6
  pour Bottom: 0.63,53.81 98.93,53.81 98.86,0.6 0.63,0.47
LINK
  Top 0.152: R1.2 66.34,33.11 69.79,33.11 SV2.26
  Route15 0.152: U$1.P$1 96.41,33.16 96.34,33.16 93.57,30.39 75.05,30.39 72.99,32.45 71.93,32.45 71.22,33.16 SV2.26
N$2
  Top 0.152: IC5.40 22.27,33.69 20.47,33.69 16.81,30.04 Q1.2 15.82,24.75 15.82,23.86 C1.1
N$3
  Top 0.152: IC5.39 22.27,34.3 16.91,34.3 16.81,34.4 Q1.1 C2.1
N$4
  Top 0.203: C14.1 30.09,10.25 30.09,13.53 U$3.1
N$6
  Top 0.203: D1.C 26.46,3.01 L1.1 27.17,6.26 27.17,8.47 C14.2 26.39,10.25 26.39,13.53 U$3.8
N$7  (via drill 0.3)
  Top 0.152: v25.27,44.01 25.27,39.79 IC5.31
  Route15 0.152: v25.27,44.01 35.68,44.01 42.46,50.79 45.66,50.79 45.92,51.04 53.41,51.04 69.92,34.53 80.46,34.53 81.17,33.82 U$1.P$7
N$8  (via drill 0.3)
  Top 0.152: v24.58,42.86 24.81,42.63 24.81,39.79 IC5.32
  Route2 0.152: v24.58,42.86 24.58,44.23 28.7,48.35 63.9,48.35 67.56,44.69 73.45,44.69 75.08,43.07 75.08,30.75 75.36,30.47 78.3,30.47 79.04,31.2 79.04,32.75 U$1.P$8
N$9
  Route2 0.152: U$2.P$7 85.97,37.73 85.97,35.98 88.49,33.46 88.49,33.06 89.1,32.45 93.16,32.45 93.87,33.16 U$1.P$2
N$10
  Top 0.152: LINK.C 63.24,27.77 63.24,28.61 62.94,28.92 62.94,31.33 R1.1
N$11  (via drill 0.3)
  Top 0.152: v35.45,32.83 35.1,33.19 34.87,33.19 IC5.8 | v54.66,47.31 55.09,47.74 R18.2 56.69,49.31 57.78,50.41 57.78,50.46 60.02,52.69 60.37,52.69 S1.2
  Route15 0.152: v35.45,32.83 40.18,32.83 v54.66,47.31
N$12
  Route15 0.152: U$2.P$4 85.03,40.6 85.97,40.6 87.37,39.2 88.64,39.2 91.74,36.11 91.74,34.23 U$1.P$3
N$13
  Route2 0.152: U$2.P$3 87.24,40.27 87.24,36.18 89.2,34.23 U$1.P$4
N$14
  Route15 0.152: U$2.P$6 88.01,37.73 88.01,34.91 87.32,34.23 U$1.P$5
N$15
  Top 0.152: C3.1 82.8,30.59 82.8,32.78 83.03,33.01 83.03,37.73 U$2.P$8
N$16
  Top 0.152: C4.1 86.61,30.59 86.61,31.51 88.41,33.31 88.41,35.93 U$2.P$5
N$17  (via drill 0.3)
  Top 0.152: v93.29,31.03 93.72,30.59 C5.1
  Route15 0.152: v93.29,31.03 93.29,37.12 89.96,40.45 U$2.P$2
N$18
  Top 0.152: PWR.C 65.02,19.37 65.78,19.37 R9.2
N$19
  Top 0.152: C6.1 90.95,30.59 90.95,36.84 91.69,37.58 91.69,40.27 U$2.P$1
N$21
  Top 0.152: R3.2 59.48,24.24 57.5,26.23 R6.1 55.52,27.8 52.7,27.8 51.96,28.54 51.71,28.54 IC1.6
N$22
  Top 0.152: R5.1 40.99,26.23 40.99,24.24 R2.2 41.78,24.24 46.07,28.54 IC1.2
N$23
  Top 0.152: R15.2 44.8,40.98 46.73,40.98 C8.+ IC1.12
N$24  (via drill 0.3)
  Top 0.152: v38.43,34.43 36.98,35.88 35.3,35.88 35.23,35.8 34.87,35.8 IC5.13 | R16.1 67.58,40.12 67.58,39.33 70.15,36.77 SV2.28
  Route2 0.152: v38.43,34.43 42.67,34.43 47.98,29.12 63.16,29.12 69.74,35.7 SV2.28
N$25
  Top 0.152: HB.A 64.13,40.12 R16.2
N$26  (via drill 0.3)
  Top 0.305: 52.07,3.85 54.02,3.85 IC3.8 | 52.07,3.85 51.48,3.85 D2.C | 52.07,3.85 v52.07,3.97
  Route2 0.305: v52.07,3.97 46.86,9.18 46.86,10.4 C12.C+
N$28
  Top 0.152: IC3.1 61.41,3.44 63.72,3.44 Q3.2
N$29
  Top 0.152: IC3.2 61.41,5.12 63.34,5.12 63.72,5.5 Q3.1
N$30
  Top 0.152: R12.2 46.07,21.45 46.98,21.45 48,22.47 C11.+ 48,24.6 47.9,24.7 47.9,28.54 IC1.3
N$31
  Top 0.152: R13.2 55.52,23.46 53.59,23.46 C10.+ 51.81,24.6 50.44,25.97 50.44,28.54 IC1.5
N$32
  Top 0.152: C9.+ 54.35,40.98 52.42,40.98 R14.2 50.44,40.2 50.44,35.9 IC1.10
N$33
  Top 0.152: IC1.9 51.71,33.74 52.01,33.44 55.52,33.44 R7.1 57.5,34.15 58.06,34.71 58.06,40.2 R4.2
N$35
  Top 0.152: R10.1 R8.1 40.99,36.21 45.51,36.21 45.82,35.9 46.07,35.9 IC1.13
OC0  (via drill 0.3)
  Top 0.254: v79.27,16.78 79.7,17.21 IC2.18
  Route2 0.254: v79.27,16.78 77.03,16.78 73.76,13.5 SV2.9
OC1  (via drill 0.3)
  Top 0.254: v80.39,16.62 80.97,17.21 IC2.17
  Route15 0.254: v80.39,16.62 80.11,16.62 77.74,14.26 71.98,14.26 71.22,13.5 SV2.10
OC2
  Top 0.254: IC2.16 82.24,17.21 82.11,17.21 80.84,15.94 73.76,15.94 SV2.11
OC3
  Top 0.254: IC2.15 83.51,17.21 83.38,17.21 80.79,14.62 71.98,14.62 71.22,15.38 SV2.12
OC4
  Top 0.254: IC2.14 84.78,19.19 84.65,19.19 84.3,19.54 74.72,19.54 73.76,18.58 SV2.13
OC5
  Top 0.254: IC2.13 86.05,19.19 85.92,19.19 85.11,20 73.78,20 73.12,19.34 71.98,19.34 71.22,18.58 SV2.14
OC6
  Top 0.254: IC2.12 87.32,19.19 87.19,19.19 85.47,20.92 73.76,20.92 SV2.15
OC7  (via drill 0.3)
  Top 0.254: v88.01,19.77 88.59,19.19 IC2.11
  Route2 0.254: v88.01,19.77 73.55,19.77 73.48,19.7 71.98,19.7 71.22,20.46 SV2.16
ROTA  (via drill 0.3)
  Top 0.203: v35.58,35.24 34.87,35.24 IC5.12
  Route2 0.203: v35.58,35.24 62.35,35.24 69.69,42.58 71.55,42.58 72.28,43.32 SV2.33
ROTB  (via drill 0.3)
  Top 0.152: v33.09,35.24 33.55,34.78 33.68,34.78 IC5.11
  Route2 0.152: v33.09,35.24 34.67,35.24 35.3,35.88 48.59,35.88 48.61,35.85 53.92,35.85 61.39,43.32 69.74,43.32 SV2.34
SCA  (via drill 0.3)
  Top 0.152: v24.2,35.7 23.72,36.18 23.46,36.18 IC5.35 | v49.09,15.76 49.53,15.33 R21.1 51.1,13.55 54.1,10.55 54.1,7.73 IC3.5
  Route2 0.152: v35.94,24.96 39.9,24.96 v49.09,15.76
  Route15 0.152: v24.2,35.7 25.19,35.7 v35.94,24.96 | SV2.21 72.28,28.08 71.62,28.08 70.45,26.91 60.42,26.91 49.42,15.91 v49.09,15.76
SCL  (via drill 0.3)
  Top 0.152: IC3.6 54.02,6.39 53.21,7.2 51.1,7.2 R20.1 49.53,8.98 v49.09,9.41 | v24.12,36.69 23.46,36.69 IC5.34
  Route15 0.152: v24.12,36.69 24.73,36.69 35.33,26.1 38.02,26.1 41.04,29.12 49.53,29.12 | 49.53,29.12 69.72,29.12 70.5,29.91 71.57,29.91 72.28,30.62 SV2.23 73.35,30.21 74.06,29.5 74.06,25.44 73.35,24.73 73.35,24.07 SV2.17 | v49.09,9.41 49.09,14.85 48.46,15.48 48.46,26.61 49.53,27.67 49.53,29.12
SDO  (via drill 0.3)
  Top 0.152: v23.36,40.02 21.97,38.62 21.97,35.98 22.14,35.8 22.27,35.8 IC5.36
  Route2 0.152: v23.36,40.02 34.44,28.94 46.98,28.94 51.1,24.83 71.57,24.83 72.28,25.54 SV2.19
USART2RX  (via drill 0.3)
  Top 0.152: v33.07,32.27 33.55,31.79 33.68,31.79 IC5.5
  Route2 0.152: SV2.37 72.28,48.4 71.62,48.4 70.91,47.69 65.07,47.69 64.05,48.7 48.05,48.7 47.09,49.67 SR2.2
  Route15 0.152: v33.07,32.27 34.46,33.67 34.46,37.71 46.02,49.26 SR2.2
USART2TX  (via drill 0.3)
  Top 0.152: v33.09,31.23 33.68,31.23 IC5.4
  Route2 0.152: SV2.38 69.74,49.06 50.24,49.06 49.63,49.67 SR2.1
  Route15 0.152: v33.09,31.23 33.09,31.38 34.82,33.11 34.82,35.67 41.78,42.63 41.78,42.89 SR2.1
V+  (via drill 0.3)
  Top 0.305: v89.28,19.77 89.86,19.19 IC2.10 | v48.89,27.95 IC1.4 | 15.64,11.6 18.28,11.6 18.89,12.21 C13.+ 20.47,15.08 U$3.7 v27.63,15.08 | 15.64,11.6 14.32,11.6 C18.1 | v15.64,11.47 15.64,11.6
  Route2 0.305: v89.28,19.77 89.02,19.77 81.5,27.29 49.55,27.29 v48.89,27.95 | 14.93,6.97 14.93,10.76 v15.64,11.47 | 14.93,6.97 14.93,3.75 DC-IN.2 | SV1.40 4.11,50.53 4.11,50 2.61,48.5 2.61,8.32 3.96,6.97 14.93,6.97
  Route15 0.305: v27.63,15.08 40.36,27.8 48.56,27.8 v48.89,27.95
VDD  (via drill 0.3)
  Top 0.203: D2.A 46.98,4.97 46.98,7.2 R20.2 | R21.2 47.65,13.55 47.65,8.98 R20.2 | L1.2 33.22,6.26 v34.11,6.26 35.81,6.26 37.94,8.39 C7.+ 39.52,8.39 46.68,8.39 R20.2 | 65.35,28.71 65.35,26.07 65.02,25.74 65.02,23 PWR.A | 65.35,28.71 65.02,29.04 LINK.A | C15.2 27.66,41.49 27.66,40.09 27.78,39.97 27.78,39.79 IC5.26 27.83,38.59 v27.83,38.01 | v28.82,28.97 28.82,28.38 IC5.57 | v33.09,34.25 33.68,34.25 IC5.10 | v24.05,34.76 23.46,34.76 IC5.38 | v33.14,25.82 33.14,25.23 C16.2 | v34.79,39.66 35.3,40.17 R22.2 | v42.74,51.42 42.16,51.42 R19.2 | C20.1 23.26,48.45 23.26,49.77 ICSP.2 | v32.69,51.4 32.1,51.4 R17.2 | v57.63,51.35 57.04,51.35 R18.1 | U$1.P$9 C19.2 75.84,30.44 75.28,29.88 70.43,29.88 69.31,28.77 65.42,28.77 65.35,28.71 | U$3.4 v32.84,17.61
  Route2 0.203: v34.79,39.66 31.26,36.13 31.17,35.99
  Bottom 0.203: C21.2 76.78,34.73 76.78,34.3 U$1.P$9
  pour Route2: 32.38,25.87 22.22,33.49 22.22,53.81 75.56,53.81 78.1,50 78.1,30.95 75.56,30.95 75.56,50 70.48,50 67.94,51.27 26.03,51.27 23.49,48.73 23.49,41.11 34.92,33.49 34.92,14.44 36.19,13.17 40,13.17 40,3.01 31.11,3.01 31.11,18.25 32.38,19.52
VPP  (via drill 0.3)
  Top 0.152: v33.09,33.24 33.52,32.8 33.68,32.8 IC5.7 | R17.1 30.12,49.39 27.55,49.39 26.77,50.18 ICSP.1
  Route15 0.152: v33.09,33.24 33.09,33.34 31.39,35.04 31.39,40.91 28.93,43.37 24.99,43.37 24.63,43.73 24.63,49.47 25.7,50.53 ICSP.1